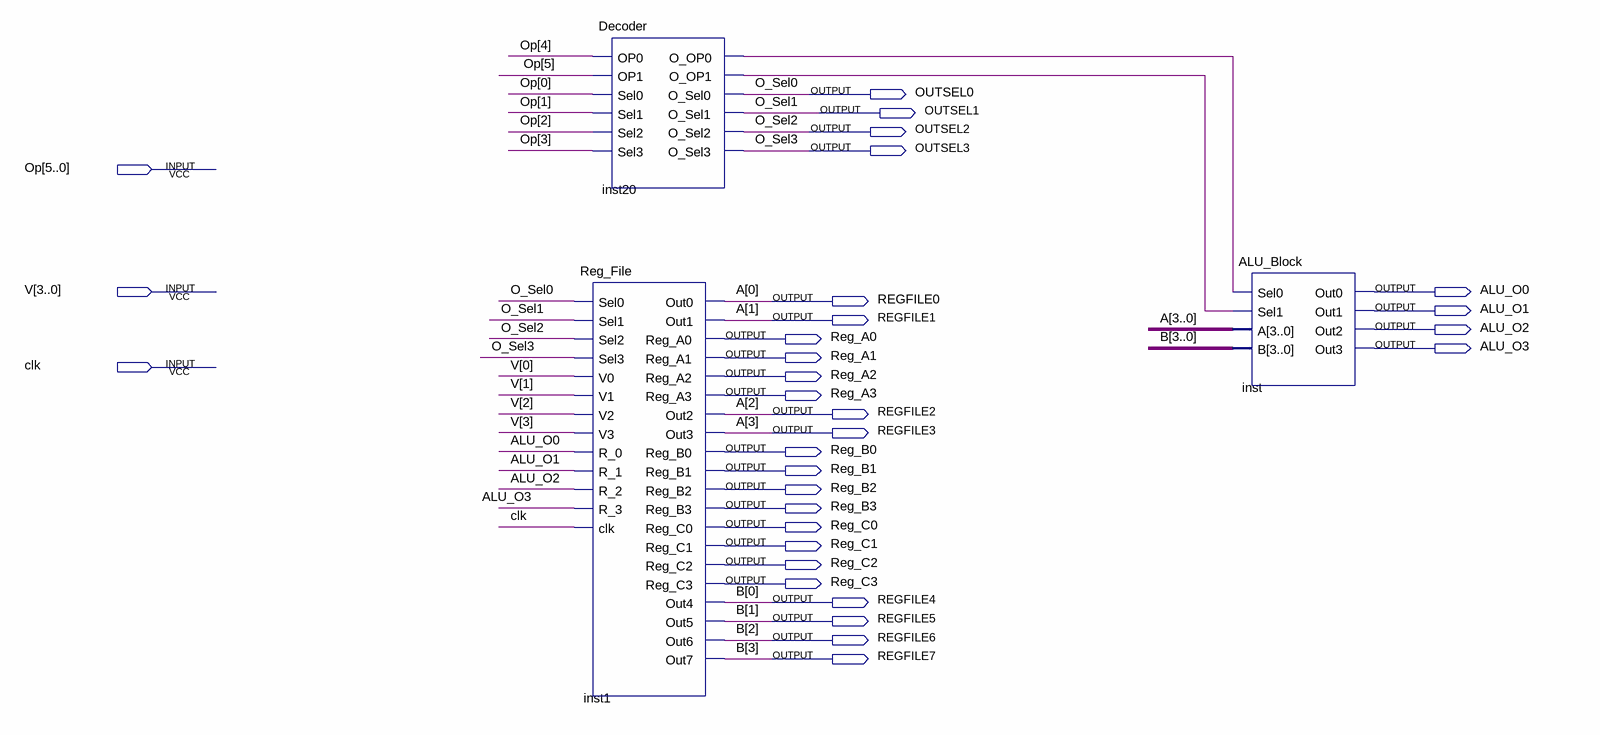
[diagram p0: schematic sheet]
// Quartus schematic EU.bdf as structural Verilog: 3 symbols, 31 pins
module EU (
  input  [5:0] Op,
  input  [3:0] V,
  input  clk,
  output OUTSEL0,
  output OUTSEL1,
  output OUTSEL2,
  output OUTSEL3,
  output ALU_O0,
  output REGFILE0,
  output ALU_O1,
  output REGFILE1,
  output ALU_O2,
  output Reg_A0,
  output ALU_O3,
  output Reg_A1,
  output Reg_A2,
  output Reg_A3,
  output REGFILE2,
  output REGFILE3,
  output Reg_B0,
  output Reg_B1,
  output Reg_B2,
  output Reg_B3,
  output Reg_C0,
  output Reg_C1,
  output Reg_C2,
  output Reg_C3,
  output REGFILE4,
  output REGFILE5,
  output REGFILE6,
  output REGFILE7
);

  wire inst20_o_op0, inst20_o_op1;

  Reg_File inst1 (
    .Sel0(OUTSEL0), .Sel1(OUTSEL1), .Sel2(OUTSEL2), .Sel3(OUTSEL3), .V0(V[0]), .V1(V[1]), .V2(V[2]),
    .V3(V[3]), .R_0(ALU_O0), .R_1(ALU_O1), .R_2(ALU_O2), .R_3(ALU_O3), .clk(clk), .Out0(REGFILE0),
    .Out1(REGFILE1), .Reg_A0(Reg_A0), .Reg_A1(Reg_A1), .Reg_A2(Reg_A2), .Reg_A3(Reg_A3), .Out2(REGFILE2),
    .Out3(REGFILE3), .Reg_B0(Reg_B0), .Reg_B1(Reg_B1), .Reg_B2(Reg_B2), .Reg_B3(Reg_B3), .Reg_C0(Reg_C0),
    .Reg_C1(Reg_C1), .Reg_C2(Reg_C2), .Reg_C3(Reg_C3), .Out4(REGFILE4), .Out5(REGFILE5), .Out6(REGFILE6),
    .Out7(REGFILE7));
  Decoder inst20 (
    .OP0(Op[4]), .OP1(Op[5]), .Sel0(Op[0]), .Sel1(Op[1]), .Sel2(Op[2]), .Sel3(Op[3]), .O_OP0(inst20_o_op0),
    .O_OP1(inst20_o_op1), .O_Sel0(OUTSEL0), .O_Sel1(OUTSEL1), .O_Sel2(OUTSEL2), .O_Sel3(OUTSEL3));
  ALU_Block inst (
    .Sel0(inst20_o_op0), .Sel1(inst20_o_op1), .A({REGFILE3, REGFILE2, REGFILE1, REGFILE0}),
    .B({REGFILE7, REGFILE6, REGFILE5, REGFILE4}), .Out0(ALU_O0), .Out1(ALU_O1), .Out2(ALU_O2), .Out3(ALU_O3));

  // Other names for the same wires on the sheet: A[3:0] = {REGFILE3, REGFILE2, REGFILE1, REGFILE0};
  //   B[3:0] = {REGFILE7, REGFILE6, REGFILE5, REGFILE4}; O_Sel0 = OUTSEL0; O_Sel1 = OUTSEL1; O_Sel2 = OUTSEL2;
  //   O_Sel3 = OUTSEL3
endmodule
